# EAGLE design Mainboard (EAGLE 7.6.0)
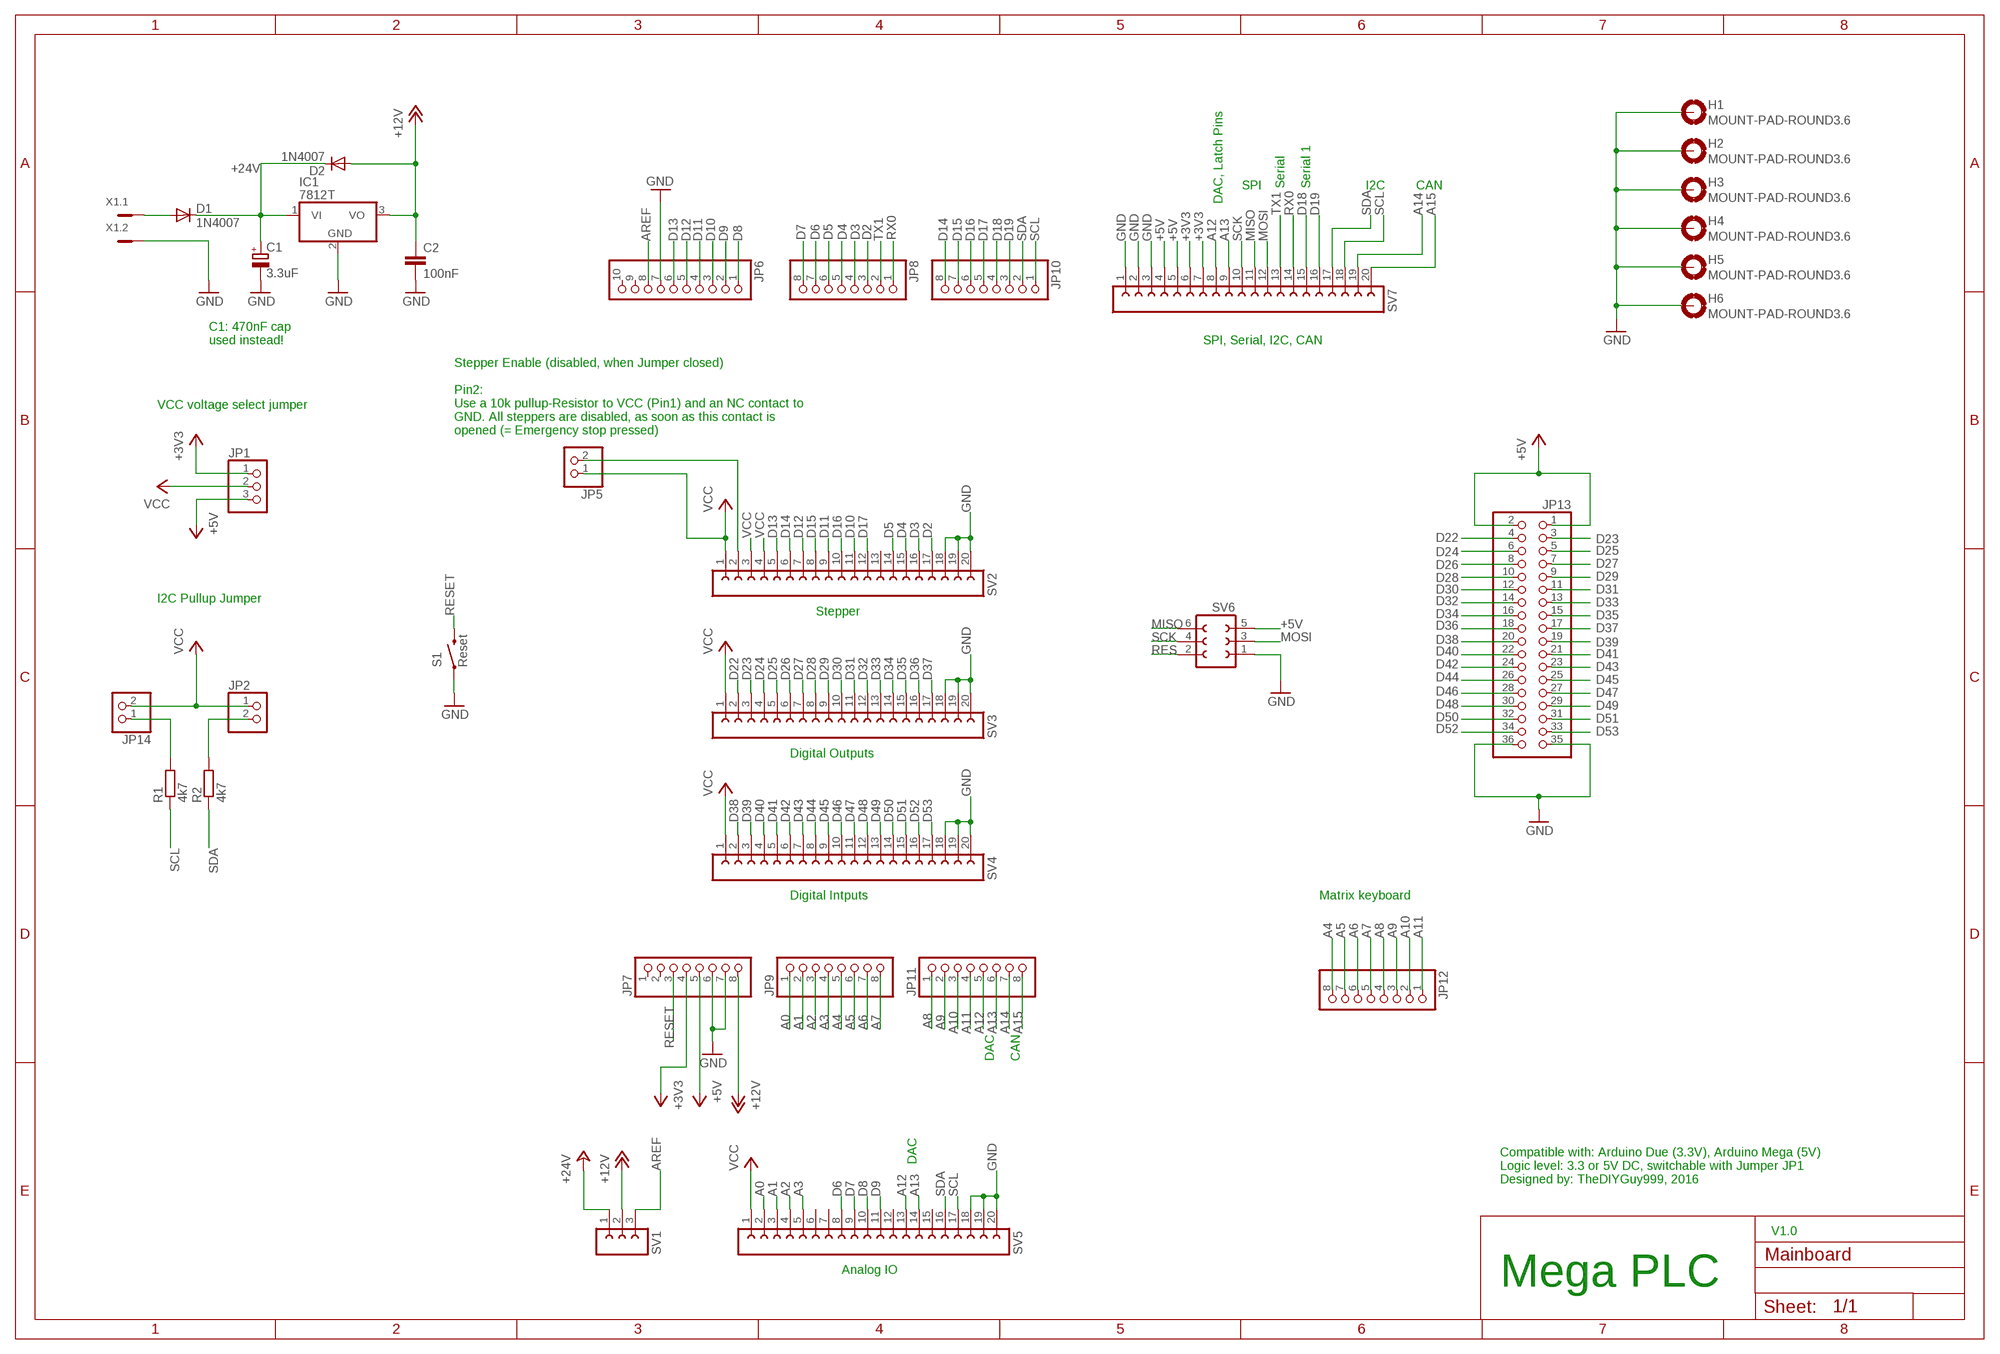
[diagram p0: schematic, sheet 1]

## Parts
C1  3.3uF  CPOL-EUB45181A  [B45181A]
C2  100nF  C-EU025-024X044  [C025-024X044]
D1  1N4007  1N4004  [DO41-10]
D2  1N4007  1N4004  [DO41-10]
H1  MOUNT-PAD-ROUND3.6  [3,6-PAD]
H2  MOUNT-PAD-ROUND3.6  [3,6-PAD]
H3  MOUNT-PAD-ROUND3.6  [3,6-PAD]
H4  MOUNT-PAD-ROUND3.6  [3,6-PAD]
H5  MOUNT-PAD-ROUND3.6  [3,6-PAD]
H6  MOUNT-PAD-ROUND3.6  [3,6-PAD]
IC1  7812T  [TO220H]
JP1  PINHD-1X3  [1X03]
JP2  PINHD-1X2  [1X02]
JP5  PINHD-1X2  [1X02]
JP6  PINHD-1X10  [1X10]
JP7  PINHD-1X8  [1X08]
JP8  PINHD-1X8  [1X08]
JP9  PINHD-1X8  [1X08]
JP10  PINHD-1X8  [1X08]
JP11  PINHD-1X8  [1X08]
JP12  PINHD-1X8  [1X08]
JP13  PINHD-2X18  [2X18]
JP14  PINHD-1X2  [1X02]
R1  4k7  R-EU_0207/10  [0207/10]
R2  4k7  R-EU_0207/10  [0207/10]
S1  Reset  SWITCH-MOMENTARY-2PTH  [TACTILE-PTH]
SV1  FE03-1  [FE03-1]
SV2  FE20-1  [FE20]
SV3  FE20-1  [FE20]
SV4  FE20-1  [FE20]
SV5  FE20-1  [FE20]
SV6  FE03-2  [FE03-2]
SV7  FE20-1  [FE20]
X1  MC2  [MC2]

## Nets
+3V3: JP1.1 JP7.4 SV7.6 SV7.7
+5V [Power]: JP1.3 JP7.5 JP13.1 JP13.2 SV6.5 SV7.4 SV7.5
+12V [Power]: C2.1 D2.A IC1.3(VO) JP7.8 SV1.2
+24V [Power]: C1.+ D1.C D2.C IC1.1(VI) SV1.1
A0 [Analog]: JP9.1 SV5.2
A1 [Analog]: JP9.2 SV5.3
A2 [Analog]: JP9.3 SV5.4
A3 [Analog]: JP9.4 SV5.5
A4: JP9.5 JP12.8
A5: JP9.6 JP12.7
A6: JP9.7 JP12.6
A7: JP9.8 JP12.5
A8: JP11.1 JP12.4
A9: JP11.2 JP12.3
A10: JP11.3 JP12.2
A11: JP11.4 JP12.1
A12: JP11.5 SV5.13 SV7.8
A13: JP11.6 SV5.14 SV7.9
A14: JP11.7 SV7.19
A15: JP11.8 SV7.20
AREF [AREF]: JP6.8 SV1.3
D2: JP8.3 SV2.17
D3: JP8.4 SV2.16
D4: JP8.5 SV2.15
D5: JP8.6 SV2.14
D6: JP8.7 SV5.8
D7: JP8.8 SV5.9
D8: JP6.1 SV5.10
D9: JP6.2 SV5.11
D10: JP6.3 SV2.11
D11: JP6.4 SV2.9
D12: JP6.5 SV2.7
D13: JP6.6 SV2.5
D14: JP10.8 SV2.6
D15: JP10.7 SV2.8
D16: JP10.6 SV2.10
D17: JP10.5 SV2.12
D18: JP10.4 SV7.15
D19: JP10.3 SV7.16
D22: JP13.4 SV3.2
D23: JP13.3 SV3.3
D24: JP13.6 SV3.4
D25: JP13.5 SV3.5
D26: JP13.8 SV3.6
D27: JP13.7 SV3.7
D28: JP13.10 SV3.8
D29: JP13.9 SV3.9
D30: JP13.12 SV3.10
D31: JP13.11 SV3.11
D32: JP13.14 SV3.12
D33: JP13.13 SV3.13
D34: JP13.16 SV3.14
D35: JP13.15 SV3.15
D36: JP13.18 SV3.16
D37: JP13.17 SV3.17
D38: JP13.20 SV4.2
D39: JP13.19 SV4.3
D40: JP13.22 SV4.4
D41: JP13.21 SV4.5
D42: JP13.24 SV4.6
D43: JP13.23 SV4.7
D44: JP13.26 SV4.8
D45: JP13.25 SV4.9
D46: JP13.28 SV4.10
D47: JP13.27 SV4.11
D48: JP13.30 SV4.12
D49: JP13.29 SV4.13
D50: JP13.32 SV4.14
D51: JP13.31 SV4.15
D52: JP13.34 SV4.16
D53: JP13.33 SV4.17
GND [Power]: C1.- C2.2 H1.B3,6(MOUNT) H2.B3,6(MOUNT) H3.B3,6(MOUNT) H4.B3,6(MOUNT) H5.B3,6(MOUNT) H6.B3,6(MOUNT) IC1.2(GND) JP6.7 JP7.6 JP7.7 JP13.35 JP13.36 S1.1 SV2.18 SV2.19 SV2.20 SV3.18 SV3.19 SV3.20 SV4.18 SV4.19 SV4.20 SV5.18 SV5.19 SV5.20 SV6.1 SV7.1 SV7.2 SV7.3 X1.2
MISO: SV6.6 SV7.11
MOSI: SV6.3 SV7.12
N$1: JP5.2 SV2.2
N$2 [Power]: D1.A X1.1
RES: SV6.2
RESET: JP7.3 S1.3
RX0: JP8.1 SV7.14
SCK: SV6.4 SV7.10
SCL: JP10.1 R1.1 SV5.17 SV7.18
SCL_PULLUP: JP14.1 R1.2
SDA: JP10.2 R2.1 SV5.16 SV7.17
SDA_PULLUP: JP2.2 R2.2
TX1: JP8.2 SV7.13
VCC [Power]: JP1.2 JP2.1 JP5.1 JP14.2 SV2.1 SV2.3 SV2.4 SV3.1 SV4.1 SV5.1
Unconnected: JP6.9 JP6.10 JP7.1 JP7.2 SV2.13 SV5.6 SV5.7 SV5.12 SV5.15

## Notes on the sheet
- SPI | Serial | Serial 1 | I2C | CAN
- DAC, Latch Pins
- C1: 470nF cap
  used instead!
- SPI, Serial, I2C, CAN
- VCC voltage select jumper
- Stepper Enable (disabled, when Jumper closed)
  
  Pin2:
  Use a 10k pullup-Resistor to VCC (Pin1) and an NC contact to
  GND. All steppers are disabled, as soon as this contact is
  opened (= Emergency stop pressed)
- I2C Pullup Jumper
- Stepper
- Digital Outputs
- Digital Intputs | Matrix keyboard
- DAC | CAN
- DAC
- Compatible with: Arduino Due (3.3V), Arduino Mega (5V)
  Logic level: 3.3 or 5V DC, switchable with Jumper JP1
  Designed by: TheDIYGuy999, 2016
- V1.0
- Analog IO
- Mega PLC

## Library data of the parts
C1 = rcl:CPOL-EU: POLARIZED CAPACITOR, European symbol
C2 = rcl:C-EU: CAPACITOR, European symbol
D1 D2 = diode:1N4004: DIODE general purpose rectifier, 1 A
H1-H6 = holes:MOUNT-PAD-ROUND: MOUNTING PAD, round
IC1 = linear:78*: Positive VOLTAGE REGULATOR Source: http://cache.national.com/ds/LM/LM78L05.pdf http://www.fairchildsemi.com/ds/LM/LM7805.pdf
JP1 = pinhead:PINHD-1X3: PIN HEADER
JP2 JP5 JP14 = pinhead:PINHD-1X2: PIN HEADER
JP6 = pinhead:PINHD-1X10: PIN HEADER
JP7-JP12 = pinhead:PINHD-1X8: PIN HEADER
JP13 = pinhead:PINHD-2X18: PIN HEADER
R1 R2 = rcl:R-EU_: RESISTOR, European symbol
S1 = SparkFun-Electromechanical:SWITCH-MOMENTARY-2: Various NO switches- pushbuttons, reed, etc
SV1 = 00_custom:FE03-1: FEMALE HEADER; OC_FARNELL: unknown; OC_NEWARK: unknown
SV2-SV5 SV7 = con-lsta:FE20-1: FEMALE HEADER; OC_FARNELL: unknown; OC_NEWARK: unknown
SV6 = 00_custom:FE03-2: FEMALE HEADER; OC_FARNELL: unknown; OC_NEWARK: unknown
X1 = 00_con-phoenix-381_l:MC2: Mini-Combicon 3.81mm horizontal 2-polig MC 1,5/2-G-3,81 Artikel-Nr. 1803277

## Net classes
0 default: width 0.305 mm
1 Power: width 0.61 mm
2 AREF: width 1.016 mm
3 Analog: width 0.61 mm

## Board
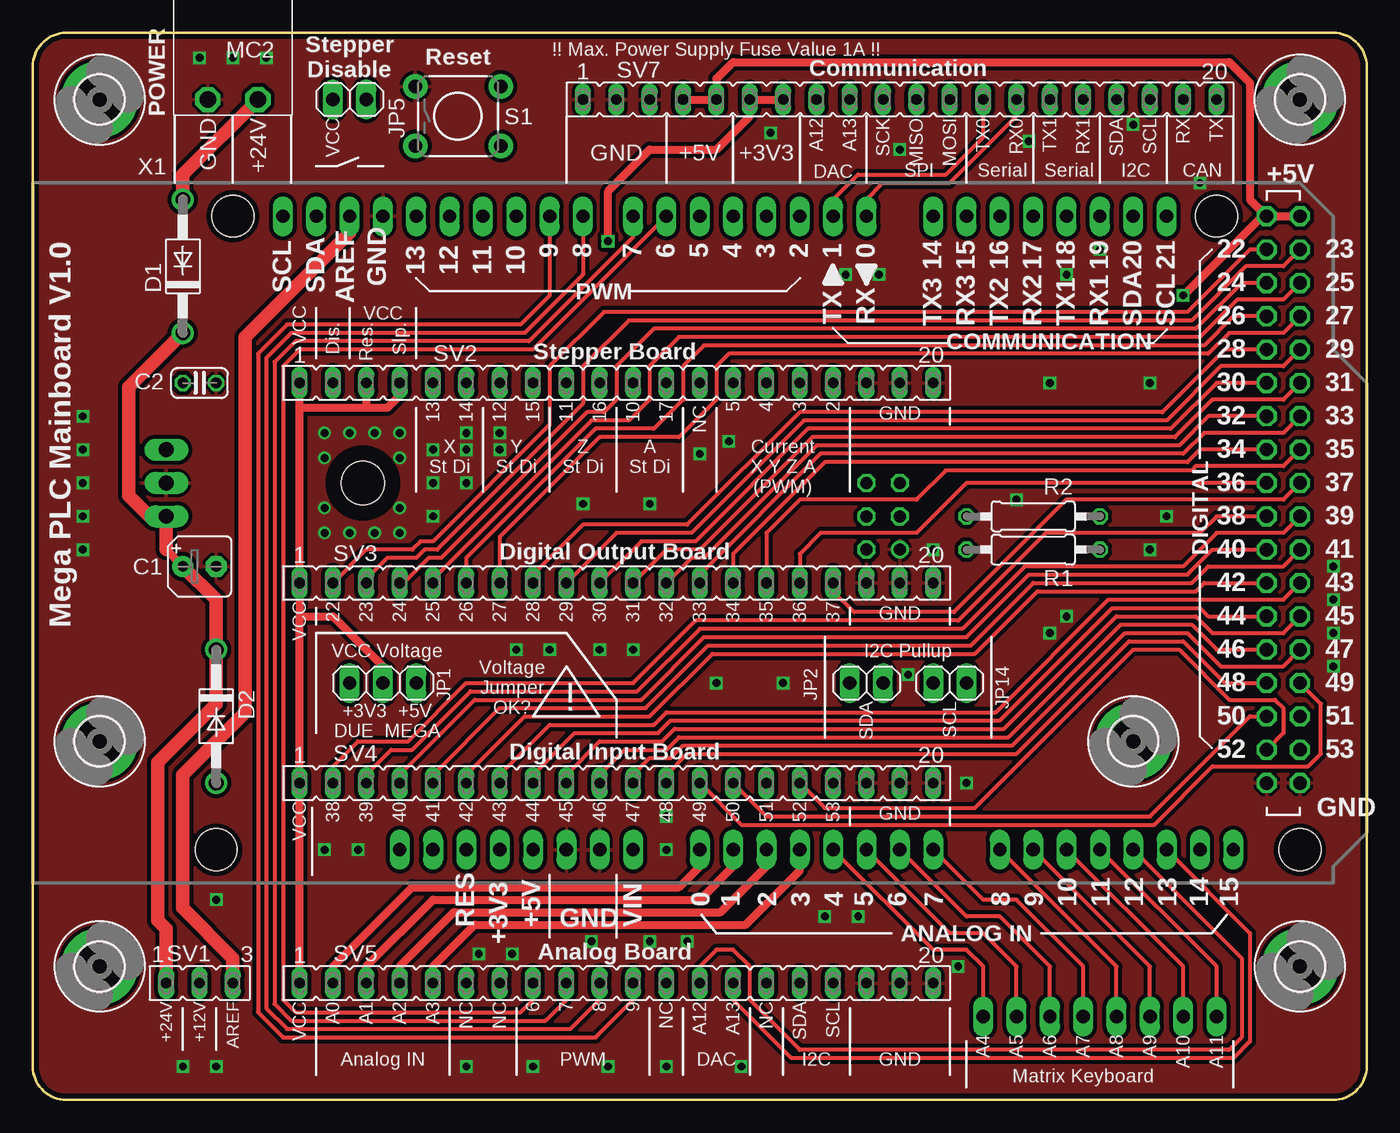
[diagram p1: board, top side]
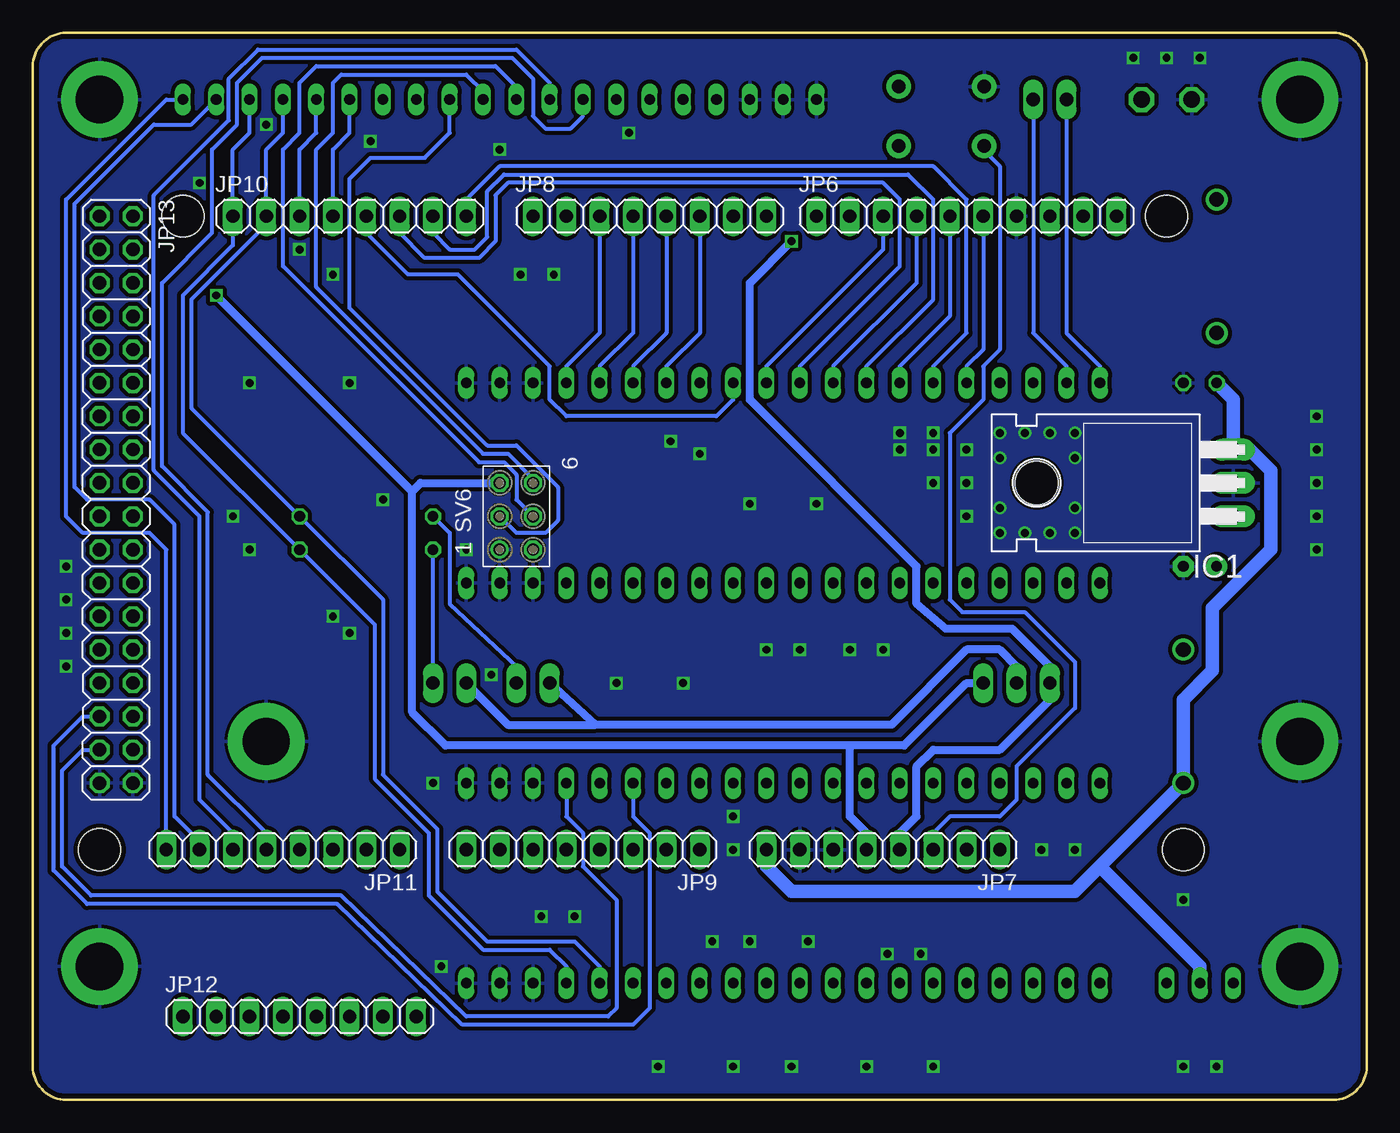
[diagram p2: board, bottom side, seen from below]

Size 101.6 x 81.28 mm. Coordinates in mm from the lower left corner, seen from the top.
Outline: 0,78.74 0,2.54 arc90 2.54,0 99.06,0 arc90 101.6,2.54 101.6,78.74 arc90 99.06,81.28 2.54,81.28 arc90 0,78.74
Copper layers (1*16): Top 0.0356mm / dielectric 1.5011mm / Bottom 0.0356mm
Design rules "OSHPark_LaenPCBOrder": minimum track width 6mil, minimum drill 13mil, track to track 6mil, track to pad 6mil, pad to pad 6mil, via to via 6mil, smd to smd 6mil, copper to edge 15mil, drill to drill 6mil, minimum pad ring 7mil, minimum via ring 7mil, stop-mask expansion 3mil, vias tented up to drill 0mil, thermal gap 10mil
Holes 3.2 mm at 15.24,67.31 13.97,19.05 90.17,67.31 96.52,19.05

### Footprints (pad centres in the part's own frame; a part is rotated, then mirrored left to right if it is on the bottom)
B45181A = drill 0.813 pad 1.6: + -1.27,0 | drill 0.813 pad 1.6 octagon: - 1.27,0
C025-024X044 = drill 0.813 octagon: 1 -1.27,0; 2 1.27,0
DO41-10 = drill 1.118: A 5.08,0; C -5.08,0
3,6-PAD = drill 3.6 pad 5.842: B3,6 0,0
TO220H = drill 1.118 long: 1 -2.54,-10.16; 2 0,-10.16; 3 2.54,-10.16 | hole 3.302: 0,4.826
1X03 = drill 1.016 long: 1 -2.54,0; 2 0,0; 3 2.54,0
1X02 = drill 1.016 long: 1 -1.27,0; 2 1.27,0
1X10 = drill 1.016 long: 1 -11.43,0; 2 -8.89,0; 3 -6.35,0; 4 -3.81,0; 5 -1.27,0; 6 1.27,0; 7 3.81,0; 8 6.35,0; 9 8.89,0; 10 11.43,0
1X08 = drill 1.016 long: 1 -8.89,0; 2 -6.35,0; 3 -3.81,0; 4 -1.27,0; 5 1.27,0; 6 3.81,0; 7 6.35,0; 8 8.89,0
2X18 = drill 1.016 octagon: 1 -21.59,-1.27; 2 -21.59,1.27; 3 -19.05,-1.27; 4 -19.05,1.27; 5 -16.51,-1.27; 6 -16.51,1.27; 7 -13.97,-1.27; 8 -13.97,1.27; 9 -11.43,-1.27; 10 -11.43,1.27; 11 -8.89,-1.27; 12 -8.89,1.27; 13 -6.35,-1.27; 14 -6.35,1.27; 15 -3.81,-1.27; 16 -3.81,1.27; 17 -1.27,-1.27; 18 -1.27,1.27; 19 1.27,-1.27; 20 1.27,1.27; 21 3.81,-1.27; 22 3.81,1.27; 23 6.35,-1.27; 24 6.35,1.27; 25 8.89,-1.27; 26 8.89,1.27; 27 11.43,-1.27; 28 11.43,1.27; 29 13.97,-1.27; 30 13.97,1.27; 31 16.51,-1.27; 32 16.51,1.27; 33 19.05,-1.27; 34 19.05,1.27; 35 21.59,-1.27; 36 21.59,1.27
0207/10 = drill 0.813 octagon: 1 -5.08,0; 2 5.08,0
TACTILE-PTH = drill 1.016 pad 1.88: 1 -3.251,2.261; 2 3.251,2.261; 3 -3.251,-2.261; 4 3.251,-2.261
FE03-1 = drill 0.813 long: 1 -2.54,0; 2 0,0; 3 2.54,0
FE20 = drill 0.813 long: 1 -24.13,0; 2 -21.59,0; 3 -19.05,0; 4 -16.51,0; 5 -13.97,0; 6 -11.43,0; 7 -8.89,0; 8 -6.35,0; 9 -3.81,0; 10 -1.27,0; 11 1.27,0; 12 3.81,0; 13 6.35,0; 14 8.89,0; 15 11.43,0; 16 13.97,0; 17 16.51,0; 18 19.05,0; 19 21.59,0; 20 24.13,0
FE03-2 = drill 0.914: 1 -2.54,1.27 | drill 0.914 octagon: 2 -2.54,-1.27; 3 0,1.27; 4 0,-1.27; 5 2.54,1.27; 6 2.54,-1.27
MC2 = drill 1.27 octagon: 1 -1.905,0; 2 1.905,0

### Placement (x,y rotation side)
C1  12.7,40.64 0 top
C2  12.7,54.61 0 top
D1  11.43,63.5 90 top
D2  13.97,29.21 270 top
H1  83.82,27.3 0 top
H2  5.08,27.3 0 top
H3  96.52,76.2 0 top
H4  5.08,76.2 0 top
H5  5.08,10.16 0 top
H6  96.52,10.16 0 top
IC1  20.32,46.99 90 bottom
JP1  26.67,31.75 0 top
JP2  63.5,31.75 0 top
JP5  24.13,76.2 0 top
JP6  30.48,67.31 0 bottom
JP7  36.83,19.05 180 bottom
JP8  54.61,67.31 0 bottom
JP9  59.69,19.05 180 bottom
JP10  77.47,67.31 0 bottom
JP11  82.55,19.05 180 bottom
JP12  81.28,6.35 0 bottom
JP13  95.25,45.72 270 bottom
JP14  69.85,31.75 180 top
R1  76.2,41.91 180 top
R2  76.2,44.45 180 top
S1  32.38,74.93 0 top
SV1  12.7,8.89 0 top
SV2  44.45,54.61 0 top
SV3  44.45,39.37 0 top
SV4  44.45,24.13 0 top
SV5  44.45,8.89 0 top
SV6  64.77,44.45 90 bottom
SV7  66.04,76.2 0 top
X1  15.24,76.2 180 top

### Tracks (layer width: path | path; a pad name or v marks a point on that pad's centre or on a via)
+3V3  (via drill 0.6)
  Top 0.61: v43.81,65.41 43.81,69.22 46.99,72.39 52.07,72.39 54.61,74.93 SV7.6 SV7.7
  Bottom 0.61: JP7.4 35.56,20.32 34.29,21.59 34.29,25.4 33.02,26.67 27.94,26.67 24.13,30.48 JP1.1 24.13,33.02 26.99,35.88 32.07,35.88 34.29,37.78 34.29,40.64 46.99,53.34 46.99,62.23 v43.81,65.41
+5V  (via drill 0.6)
  Top 0.61: SV7.4 SV7.5 52.07,77.79 53.34,79.06 91.12,79.06 92.71,77.47 92.71,68.58 JP13.2 | JP13.2 JP13.1 | JP13.2 93.66,67.31 v87.63,61.28
  Bottom 0.61: JP7.5 38.1,20.32 39.37,21.59 39.37,26.99 | 39.37,26.99 35.24,26.99 30.48,31.75 JP1.3 | 39.37,26.99 70.17,26.99 72.71,29.53 72.71,46.35 | 72.71,46.35 72.07,46.99 SV6.5 | v87.63,61.28 72.71,46.35
+12V
  Bottom 1.016: JP7.8 45.72,17.78 43.81,15.88 22.23,15.88 20.32,17.78 | SV1.2 12.7,10.16 20.32,17.78 | C2.1 10.16,53.34 IC1.3 8.89,49.53 7.3,47.94 7.3,41.91 11.75,37.47 11.75,32.7 13.97,30.48 D2.A 20.32,17.78
+24V
  Top 0.61: C1.+ 10.16,41.91
  Top 1.016: C1.+ 13.97,38.1 D2.C 13.97,30.16 9.53,25.72 9.53,13.65 10.16,13.02 SV1.1 | 10.16,41.91 IC1.1 8.89,44.45 7.3,46.04 7.3,54.29 D1.C
A0
  Top 0.61: SV5.2 22.86,10.16 28.89,16.19 49.21,16.19 50.8,17.78 JP9.1
A1
  Top 0.61: SV5.3 25.4,10.16 30.48,15.24 50.8,15.24 53.34,17.78 JP9.2
A2
  Top 0.61: SV5.4 27.94,10.16 32.07,14.29 52.39,14.29 55.88,17.78 JP9.3
A3
  Top 0.61: SV5.5 30.48,10.16 33.66,13.34 54.29,13.34 58.42,17.46 JP9.4
A4
  Top 0.305: JP12.8 72.39,10.16 71.12,11.43 68.58,11.43 JP9.5
A5
  Top 0.305: JP12.7 74.93,10.16 72.39,12.7 69.85,12.7 JP9.6
A6
  Top 0.305: JP12.6 77.47,10.16 73.66,13.97 71.12,13.97 JP9.7
A7
  Top 0.305: JP12.5 80.01,10.16 74.93,15.24 72.39,15.24 JP9.8
A8
  Top 0.305: JP12.4 82.55,10.16 JP11.1
A9
  Top 0.305: JP12.3 85.09,10.16 JP11.2
A10
  Top 0.305: JP12.2 87.63,10.16 JP11.3
A11
  Top 0.305: JP12.1 90.17,10.16 JP11.4
A12  (1 unrouted)
  Top 0.305: JP11.5 92.08,10.79 92.08,4.76 91.12,3.81 58.42,3.81 54.61,7.62 54.61,10.16 53.34,11.43 52.07,11.43 50.8,10.16 SV5.13
  Bottom 0.305: JP11.5 83.82,20.32 88.27,24.77 88.27,44.77 91.76,48.26 91.76,62.23 87.95,66.04 87.95,72.39 86.04,74.3 86.04,77.47 84.14,79.38 65.09,79.38 63.5,77.79 63.5,74.93 62.55,73.98 60.64,73.98 59.69,74.93 SV7.8
A13
  Top 0.305: JP11.6 92.71,12.7 92.71,4.45 91.44,3.17 57.78,3.17 53.34,7.62 SV5.14
  Bottom 0.305: JP11.6 86.36,20.32 88.9,22.86 88.9,44.45 92.39,47.94 92.39,68.9 86.68,74.61 86.68,77.79 84.45,80.01 64.77,80.01 62.23,77.47 SV7.9
A14
  Bottom 0.305: JP11.7 88.9,19.68 90.81,21.59 90.81,43.81 92.71,45.72 97.47,45.72 98.42,46.67 98.42,68.26 92.39,74.3 89.53,74.3 SV7.19
A15
  Bottom 0.305: JP11.8 91.44,41.91 92.71,43.18 97.79,43.18 99.06,44.45 99.06,68.58 91.44,76.2 SV7.20
AREF
  Top 1.016: JP6.8 24.13,66.04 16.19,58.1 16.19,29.53 11.43,24.77 11.43,14.61 15.24,10.79 SV1.3
D2
  Bottom 0.305: JP8.3 58.42,58.42 60.96,55.88 SV2.17
D3
  Bottom 0.305: JP8.4 55.88,58.42 58.42,55.88 SV2.16
D4
  Bottom 0.305: JP8.5 53.34,58.42 55.88,55.88 SV2.15
D5
  Bottom 0.305: JP8.6 50.8,58.42 53.34,55.88 SV2.14
D6
  Top 0.305: JP8.7 38.1,57.15 20.32,57.15 19.05,55.88 19.05,7.62 20,6.67 37.15,6.67 38.1,7.62 SV5.8
D7
  Top 0.305: JP8.8 45.72,65.72 37.78,57.78 20,57.78 18.41,56.2 18.41,7.3 19.68,6.03 39.05,6.03 40.64,7.62 SV5.9
D8
  Top 0.305: JP6.1 41.91,62.87 37.47,58.42 19.68,58.42 17.78,56.52 17.78,6.99 19.37,5.4 40.96,5.4 43.18,7.62 SV5.10
D9
  Top 0.305: JP6.2 39.37,61.28 37.15,59.05 19.37,59.05 17.14,56.83 17.14,6.67 19.05,4.76 42.86,4.76 45.72,7.62 SV5.11
D10
  Bottom 0.305: JP6.3 36.83,64.77 45.72,55.88 SV2.11
D11
  Bottom 0.305: JP6.4 34.29,62.23 40.64,55.88 SV2.9
D12
  Bottom 0.305: JP6.5 31.75,59.69 35.56,55.88 SV2.7
D13
  Bottom 0.305: JP6.6 29.21,57.15 30.48,55.88 SV2.5
D14
  Bottom 0.305: SV2.6 33.02,55.88 30.48,58.42 30.48,68.58 33.02,71.12 66.04,71.12 68.58,68.58 JP10.8
D15
  Bottom 0.305: SV2.8 38.1,55.88 33.02,60.96 33.02,68.58 34.92,70.48 65.72,70.48 66.99,69.22 66.99,65.72 67.94,64.77 69.85,64.77 71.12,66.04 JP10.7
D16
  Bottom 0.305: SV2.10 43.18,55.88 35.56,63.5 35.56,68.58 36.83,69.85 65.41,69.85 66.36,68.9 66.36,65.41 67.63,64.14 71.75,64.14 73.66,66.04 JP10.6
D17
  Bottom 0.305: SV2.12 48.26,53.34 49.53,52.07 60.96,52.07 62.23,53.34 62.23,55.88 69.22,62.87 73.03,62.87 76.2,66.04 JP10.5
D18
  Bottom 0.305: JP10.4 78.74,72.39 77.47,73.66 SV7.15
D19
  Bottom 0.305: JP10.3 81.28,72.39 80.01,73.66 SV7.16
D22
  Top 0.305: JP13.4 92.71,64.77 87.95,60.01 43.5,60.01 39.37,55.88 39.37,51.44 30.48,42.55 29.53,42.55 28.89,41.91 25.4,41.91 SV3.2
D23
  Top 0.305: JP13.3 95.25,63.5 92.39,63.5 88.27,59.37 45.4,59.37 41.91,55.88 41.91,53.02 30.8,41.91 29.84,41.91 29.21,41.27 26.99,41.27 25.4,39.69 SV3.3
D24
  Top 0.305: JP13.6 92.08,62.23 88.58,58.74 47.31,58.74 44.45,55.88 44.45,53.34 43.5,52.39 42.23,52.39 31.11,41.27 30.16,41.27 28.26,39.37 SV3.4
D25
  Top 0.305: JP13.5 95.25,60.96 91.76,60.96 88.9,58.1 49.21,58.1 46.99,55.88 46.99,53.34 45.4,51.75 42.55,51.75 30.48,39.69 SV3.5
D26
  Top 0.305: JP13.8 91.44,59.69 89.22,57.47 51.12,57.47 49.53,55.88 49.53,53.34 47.31,51.12 42.86,51.12 33.02,41.27 SV3.6
D27
  Top 0.305: JP13.7 95.25,58.42 91.12,58.42 89.53,56.83 53.02,56.83 52.07,55.88 52.07,53.34 49.21,50.48 43.18,50.48 35.56,42.86 SV3.7
D28
  Top 0.305: JP13.10 90.81,57.15 86.04,52.39 58.42,52.39 49.85,43.81 41.91,43.81 38.1,40.01 SV3.8
D29
  Top 0.305: JP13.9 95.25,55.88 90.49,55.88 86.36,51.75 58.74,51.75 50.16,43.18 44.45,43.18 SV3.9
D30
  Top 0.305: JP13.12 90.17,54.61 86.68,51.12 59.05,51.12 50.48,42.55 46.35,42.55 SV3.10
D31
  Top 0.305: JP13.11 95.25,53.34 89.85,53.34 87,50.48 59.37,50.48 50.8,41.91 48.26,41.91 SV3.11
D32
  Top 0.305: JP13.14 89.53,52.07 87.31,49.85 59.69,49.85 51.12,41.27 50.16,41.27 SV3.12
D33
  Top 0.305: JP13.13 95.25,50.8 89.22,50.8 87.63,49.21 60.01,49.21 50.8,40.01 SV3.13
D34
  Top 0.305: JP13.16 88.9,49.53 87.95,48.58 60.33,48.58 53.34,41.59 SV3.14
D35
  Top 0.305: JP13.15 95.25,48.26 88.58,48.26 88.27,47.94 69.53,47.94 67.31,45.72 58.42,45.72 55.88,43.18 SV3.15
D36
  Top 0.305: JP13.18 71.12,46.99 67.31,43.18 60.01,43.18 58.42,41.59 SV3.16
D37
  Top 0.305: JP13.17 95.25,45.72 78.74,45.72 70.17,37.15 62.55,37.15 60.96,38.73 SV3.17
D38
  Top 0.305: JP13.20 90.17,44.45 88.9,43.18 77.15,43.18 70.48,36.51 50.48,36.51 45.72,31.75 33.02,31.75 28.57,27.3 24.77,27.3 22.86,25.4 SV4.2
D39
  Top 0.305: JP13.19 95.25,43.18 90.17,43.18 87.63,40.64 75.56,40.64 70.8,35.88 50.8,35.88 46.04,31.11 33.34,31.11 28.89,26.67 27.3,26.67 25.4,24.77 SV4.3
D40
  Top 0.305: SV4.4 27.94,24.77 33.66,30.48 46.35,30.48 51.12,35.24 71.12,35.24 75.88,40.01 87.95,40.01 89.85,41.91 JP13.22
D41
  Top 0.305: SV4.5 30.48,24.77 35.56,29.84 46.67,29.84 51.44,34.61 71.44,34.61 76.2,39.37 88.27,39.37 89.53,40.64 95.25,40.64 JP13.21
D42
  Top 0.305: SV4.6 33.02,24.77 37.47,29.21 46.99,29.21 51.75,33.97 71.75,33.97 76.52,38.73 88.58,38.73 89.22,39.37 JP13.24
D43
  Top 0.305: SV4.7 35.56,24.77 39.37,28.57 47.31,28.57 48.26,29.53 73.34,29.53 81.92,38.1 95.25,38.1 JP13.23
D44
  Top 0.305: SV4.8 38.1,24.77 41.27,27.94 47.62,27.94 48.58,28.89 73.66,28.89 82.23,37.47 88.9,37.47 89.53,36.83 JP13.26
D45
  Top 0.305: SV4.9 40.64,24.77 43.18,27.3 47.94,27.3 48.9,28.26 73.98,28.26 82.55,36.83 88.58,36.83 89.85,35.56 95.25,35.56 JP13.25
D46
  Top 0.305: SV4.10 43.18,24.77 45.09,26.67 48.26,26.67 49.21,27.62 74.3,27.62 82.87,36.2 88.27,36.2 90.17,34.29 JP13.28
D47
  Top 0.305: SV4.11 45.72,24.77 46.99,26.04 48.58,26.04 49.53,26.99 74.61,26.99 83.19,35.56 87.95,35.56 90.49,33.02 95.25,33.02 JP13.27
D48
  Top 0.305: SV4.12 48.26,24.77 49.85,26.35 74.93,26.35 83.5,34.92 87.63,34.92 90.81,31.75 JP13.30
D49
  Top 0.305: SV4.13 53.98,20.95 85.41,20.95 89.85,25.4 97.16,25.4 98.11,26.35 98.11,30.16 JP13.29
D50
  Top 0.305: SV4.14 55.88,21.59 85.09,21.59 92.71,29.21 JP13.32
D51
  Bottom 0.305: JP13.31 97.79,29.21 100.01,26.99 100.01,17.46 97.47,14.92 78.42,14.92 68.9,5.71 55.88,5.71 54.61,6.99 54.61,20.32 55.88,21.59 SV4.15
D52
  Top 0.305: SV4.16 60.33,22.23 71.75,22.23 83.82,34.29 87.31,34.29 91.12,30.48 94.61,30.48 95.25,29.84 95.25,27.94 JP13.34
D53
  Bottom 0.305: SV4.17 60.96,21.59 59.69,20.32 59.69,17.78 57.15,15.24 57.15,6.99 57.78,6.35 68.58,6.35 78.11,15.56 97.16,15.56 99.38,17.78 99.38,25.08 97.79,26.67 JP13.33
GND  (via drill 0.6)
  other vias: 33.02,46.99 33.02,50.8 35.56,50.8 22.23,50.8 24.13,50.8 26.04,50.8 27.94,50.8 27.94,48.9 27.94,45.09 27.94,43.18 26.04,43.18 24.13,43.18 22.23,43.18 22.23,45.09 22.23,48.9 77.47,54.61 75.88,73.03 83.82,74.3 81.28,64.77 78.74,62.87 52.07,31.75 57.15,31.75 78.74,36.83 77.47,35.56 66.67,32.38 85.09,41.91 86.36,44.45 71.12,24.13 70.48,10.16 53.98,2.54 48.26,2.54 43.81,2.54 66.04,72.39 56.2,73.66 85.09,54.61 30.48,49.53 30.48,46.99 30.48,44.45 33.02,49.53 35.56,49.53 62.87,13.97 60.33,13.97 49.85,12.06 46.99,12.06 42.55,12.06 36.51,11.11 33.97,11.11 41.91,45.4 46.99,45.4 50.8,49.21 53.02,50.16 45.72,34.29 43.18,34.29 39.37,34.29 36.83,34.29 99.06,33.02 99.06,35.56 99.06,38.1 99.06,40.64 3.81,52.07 3.81,49.53 3.81,46.99 3.81,44.45 3.81,41.91 48.26,21.59 48.26,19.05 24.77,19.05 22.23,19.05 64.45,62.87 61.91,62.87 12.7,79.38 15.24,79.38 17.78,79.38 13.97,2.54 11.43,2.54 13.97,15.24 74.93,45.72 68.58,41.91 38.1,2.54 33.02,2.54 88.9,69.85
  pour Top (isolate 0.305): 0,0 101.6,0 101.6,82.55 0,82.55
  pour Bottom (isolate 0.305): 0,0 101.6,0 101.6,82.55 0,82.55
MISO
  Bottom 0.305: SV6.6 63.5,47.31 65.41,49.21 67.31,49.21 80.01,61.91 80.01,72.39 78.74,73.66 78.74,77.47 78.11,78.11 68.58,78.11 67.31,76.83 SV7.11
MOSI
  Bottom 0.305: SV6.3 64.77,43.18 62.55,43.18 61.59,44.13 61.59,46.67 64.77,49.85 66.99,49.85 77.47,60.33 77.47,70.17 75.88,71.75 71.75,71.75 69.85,73.66 SV7.12
N$1
  Bottom 0.305: JP5.2 25.4,58.42 22.86,55.88 SV2.2
N$2
  Top 1.016: D1.A 11.43,70.48 X1.1
RESET
  Bottom 0.305: S1.3 29.13,72.31 27.94,71.12 27.94,57.15 29.21,55.88 29.21,53.34 31.75,50.8 31.75,38.1 30.8,37.15 26.04,37.15 22.23,33.34 22.23,29.84 26.67,25.4 26.67,22.86 27.94,21.59 31.75,21.59 33.02,20.32 JP7.3
RX0
  Top 0.305: JP8.1 63.5,68.58 64.77,69.85 69.85,69.85 74.93,74.93 SV7.14
SCK
  Top 0.305: 64.77,77.15 SV7.10
  Bottom 0.305: SV6.4 64.77,45.72 64.77,47.62 65.72,48.58 67.63,48.58 82.55,63.5 82.55,72.39 81.28,73.66 81.28,77.47 80.01,78.74 66.36,78.74 64.77,77.15 SV7.10
SCL
  Bottom 0.305: SV5.17 60.96,10.16 62.23,11.43 67.31,11.43 71.44,15.56 71.44,20.32 75.56,24.45 75.56,36.2 R1.1 90.17,50.8 90.17,61.28 86.36,65.09 JP10.1 86.36,72.39 85.09,73.66 SV7.18
SCL_PULLUP
  Bottom 0.305: JP14.1 R1.2
SDA
  Bottom 0.305: SV5.16 58.42,10.16 60.33,12.06 66.99,12.06 70.8,15.88 70.8,20.64 74.93,24.77 74.93,38.1 R2.1 89.53,52.7 89.53,60.96 83.82,66.67 JP10.2 83.82,72.39 82.55,73.66 SV7.17
SDA_PULLUP
  Bottom 0.305: R2.2 69.85,43.18 69.85,37.78 64.77,33.02 JP2.2
TX1
  Top 0.305: JP8.2 60.96,68.58 62.87,70.48 69.53,70.48 72.39,73.34 SV7.13
VCC
  Top 0.61: 20.32,52.7 SV3.1 20.32,36.83 | 20.32,52.7 SV2.1 | SV5.1 SV4.1 20.32,36.83 | 20.32,36.83 22.86,36.83 26.67,33.02 JP1.2 | SV2.4 27.94,53.66 26.99,52.7 25.4,52.7 | 25.4,52.7 20.32,52.7 | SV2.3 25.4,52.7
  Bottom 0.305: JP5.1 22.86,58.42 20.32,55.88 SV2.1
  Bottom 0.61: 58.74,28.57 36.2,28.57 30.48,34.29 27.94,34.29 26.67,33.02 JP1.2 | 58.74,28.57 JP2.1 | JP14.2 65.41,28.57 58.74,28.57

### Text on the board
tPlace: !! Max. Power Supply Fuse Value 1A !! | Reset | Stepper / Disable | Communication | POWER | GND | +24V | VCC | A12 | A13 | SCK | MISO | MOSI | TX0 | RX0 | TX1 | RX1 | SDA | SCL | RX | TX | GND | +5V | +3V3 | DAC | SPI | Serial | Serial | I2C | CAN | +5V | 9 | 8 | 7 | 6 | 5 | 4 | 3 | 2 | 1 | 0 | 22 | 23 | 13 | 12 | 11 | 10 | 14 | 15 | 16 | 17 | 18 | 19 | 20 | 21 | GND | PWM | 24 | 25 | SCL | VCC | SDA | AREF | VCC | Dis. | Res. | Slp. | TX | RX | TX3 | RX3 | TX2 | RX2 | TX1 | RX1 | SDA | SCL | 26 | 27 | COMMUNICATION | 28 | 29 | Stepper Board | 30 | 31 | 13 | 14 | 12 | 15 | 11 | 16 | 10 | 17 | NC | 5 | 4 | 3 | 2 | GND | Mega PLC Mainboard V1.0 | 32 | 33 | X / St Di | Y / St Di | Z / St Di | A / St Di | Current / X Y Z A / (PWM) | 34 | 35 | 36 | 37 | DIGITAL | 38 | 39 | Digital Output Board | 40 | 41 | 42 | 43 | VCC | 22 | 23 | 24 | 25 | 26 | 27 | 28 | 29 | 30 | 31 | 32 | 33 | 34 | 35 | 36 | 37 | GND | 44 | 45 | VCC Voltage / / / +3V3 +5V / DUE MEGA | I2C Pullup | 46 | 47 | Voltage / Jumper / OK? | 48 | 49 | ! | SDA | SCL | 50 | 51 | Digital Input Board | 52 | 53 | VCC | 38 | 39 | 40 | 41 | 42 | 43 | 44 | 45 | 46 | 47 | 48 | 49 | 50 | 51 | 52 | 53 | GND | GND | 0 | 1 | 2 | 3 | 4 | 5 | 6 | 7 | 8 | 9 | 10 | 11 | 12 | 13 | 14 | 15 | RES | +5V | GND | VIN | ANALOG IN | +3V3 | Analog Board | +24V | +12V | AREF | VCC | A0 | A1 | A2 | A3 | NC | NC | 6 | 7 | 8 | 9 | NC | A12 | A13 | NC | SDA | SCL | A4 | A5 | A6 | A7 | A8 | A9 | A10 | A11 | Analog IN | PWM | DAC | I2C | GND | Matrix Keyboard